# Altium schematic sheet HX PZ2.54-1X4P ZZ.schdoc
size 127 x 101 mm
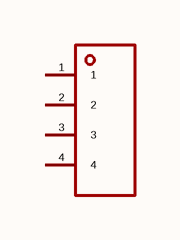
[diagram p0: HX PZ2.54-1X4P ZZ.schdoc]

## Parts
U?  hx pz2.54-1x4p zz  [HDR-TH_4P-P2.54-V-M]  (value not drawn)

## Nets

Not connected (* = marked no-connect by the designer): U? 1 2 3 4

## Library data of the parts
U? = hx pz2.54-1x4p zz: 插针结构:1x4P;间距:2.54mm;行距:-;圆针/方针:方针;安装方式:直插;排数:单排;总PIN位数:4P;额定电流:3A;额定电压:1kV;配合针长度:6mm;塑高:2.5mm;端接针长度:3mm;触头材质:黄铜;触头镀层:金;工作温度:-40℃~+105℃;颜色:黑色;; Manufacturer: hanxia(韩下); AddInBom: yes; ModelId: 112f4d05e8d64e99ab9a333894bea4f9; ModelName: HDR-TH_4P-P2.54-M-LI-1X4P; ModelTransform: 399.999,104.7242,0,0,0,0,0,0,-118.11; Pin Structure: 1x4P; Pitch: 2.54mm; Circluar Pins/Square Pins: 方针; Current Rating: 3A; Voltage Rating (Max): 1kV; Symbol: HX PZ2.54-1X4P ZZ; LCSC Part Name: 1x4P 间距:2.54mm 方针 直插; SupplierPart: C32713270; ManufacturerPart: HX PZ2.54-1x4P ZZ; Supplier Footprint: 插件,P=2.54mm; JLCPCB Part Class: Extended Part; Datasheet: https://item.szlcsc.com/datasheet/HX%2520PZ2.54-1x4P%2520ZZ/34444550.html; Supplier: LCSC; ConvertToPcb: yes; FootprintName: HDR-TH_4P-P2.54-V-M; Row Spacing: -; Mounting Type: 直插; Number of Rows: 单排; Number of Pins: 4P; Length of Mating Pin: 6mm; Insulation Height: 2.5mm; Length of End Connection Pin: 3mm; Contact Material: 黄铜; Contact Plating: 金; Operating Temperature: -40℃~+105℃; Color: 黑色; Supplementary Features: -